# Altium schematic sheet Sheet2.SchDoc
size A2; SheetNumber: 1; SheetTotal: 1
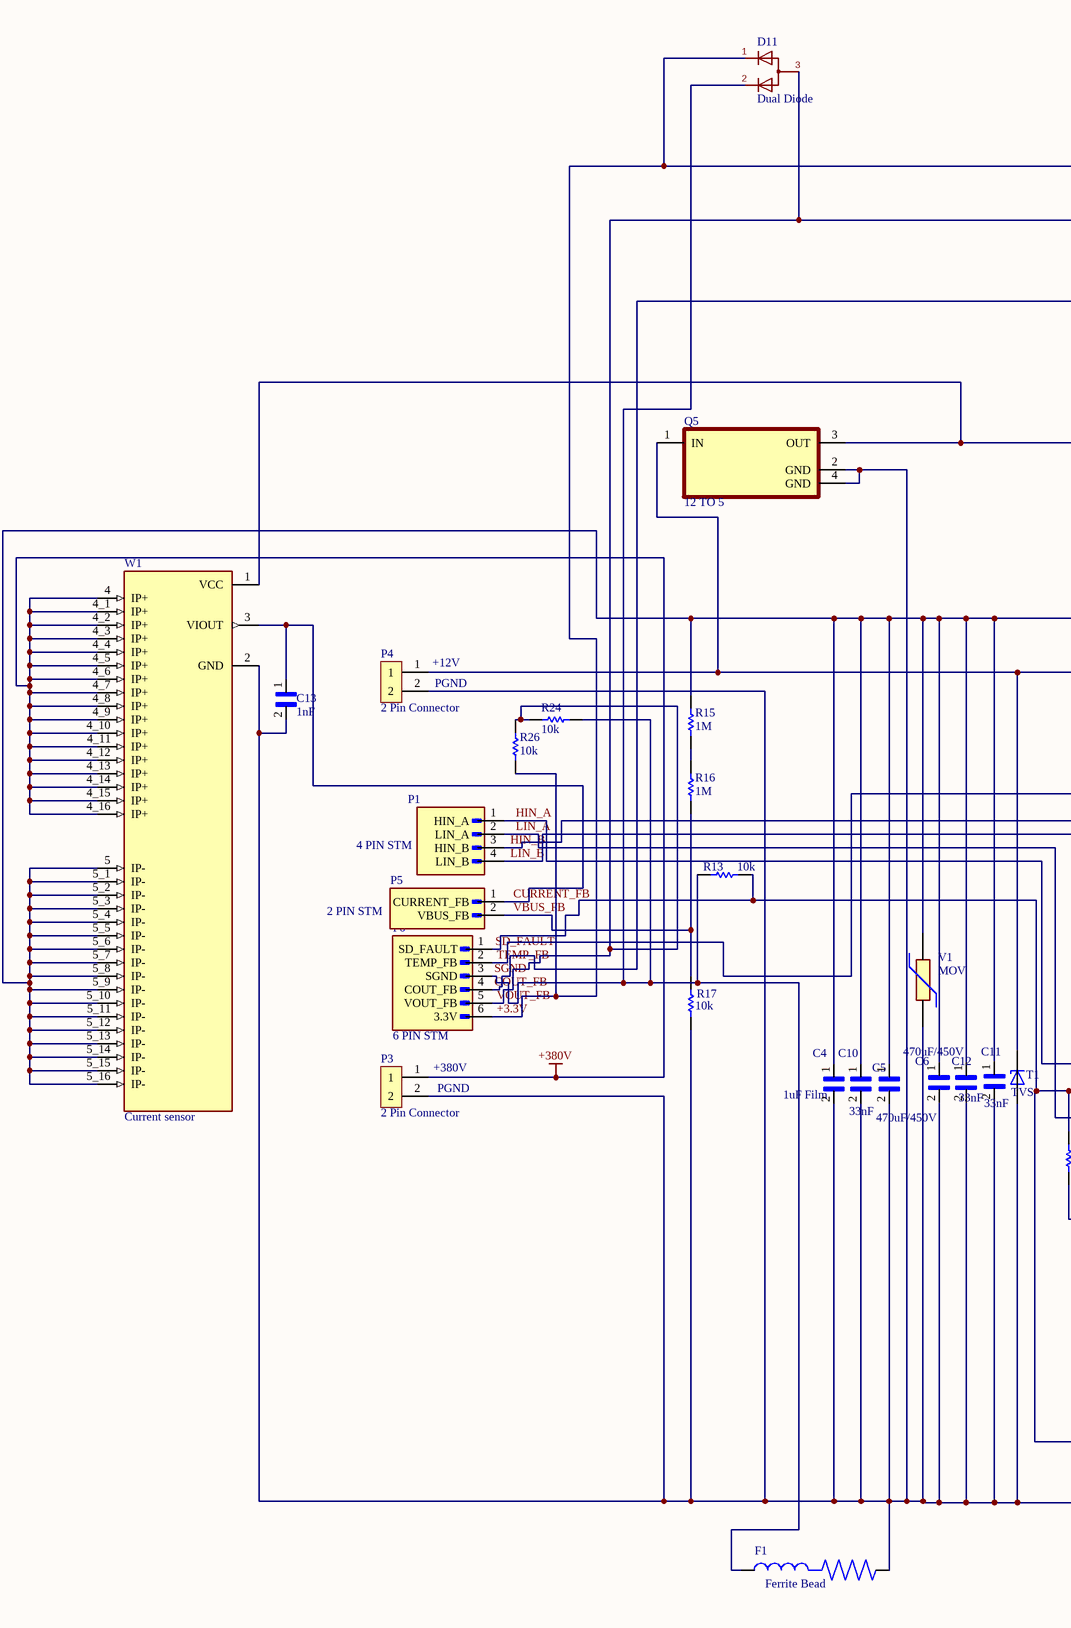
[diagram p0: Sheet2.SchDoc, left]
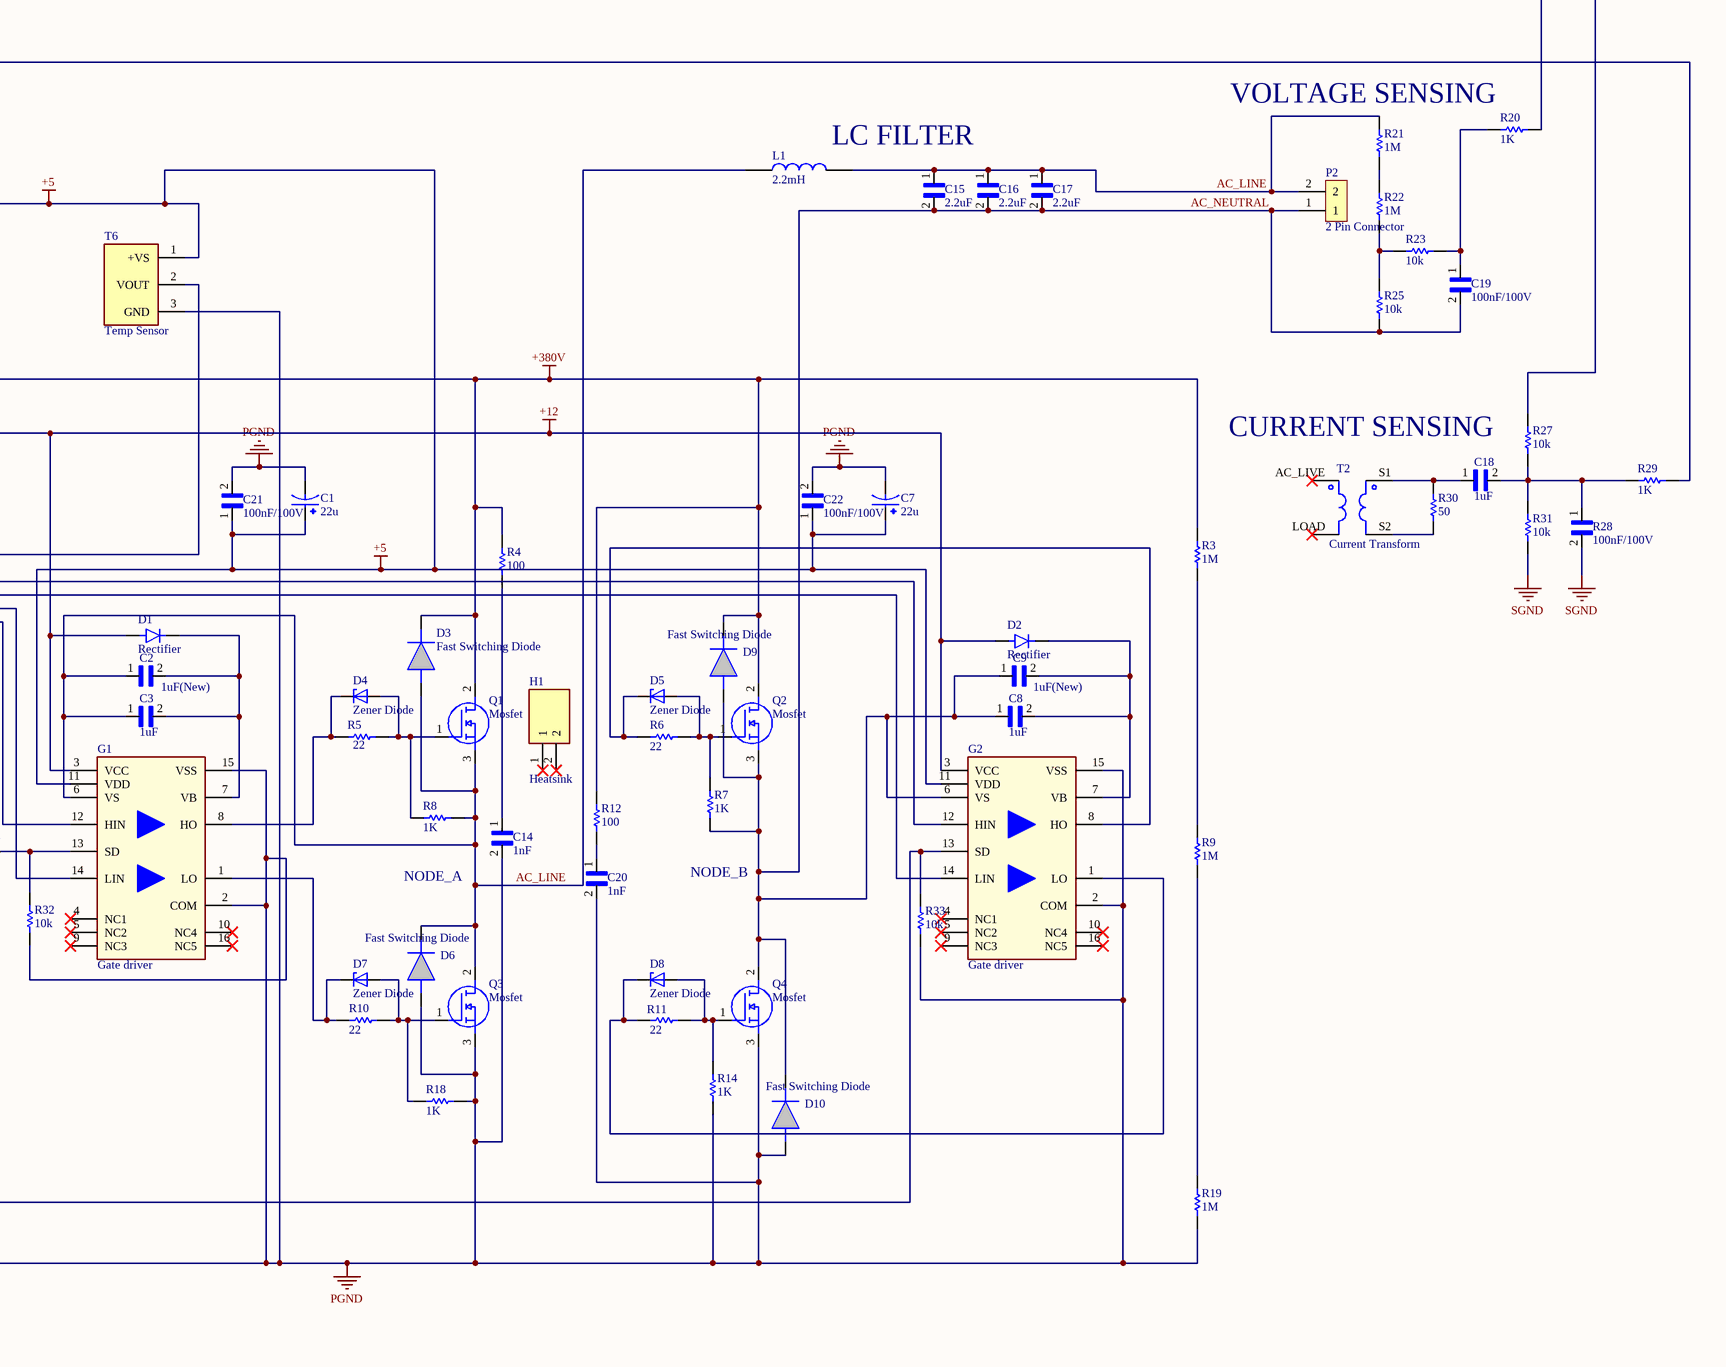
[diagram p1: Sheet2.SchDoc, right]

## Parts
C1  22u  [22uF]
C2  1uF(New)  [1uF(New)]
C3  1uF  [1uF]
C4  1uF Film  [1.0uF/630V]
C5  470uF/450V  [470 µF/450 V]
C6  470uF/450V  [470 µF/450 V]
C7  22u  [22uF]
C8  1uF  [1uF]
C9  1uF(New)  [1uF(New)]
C10  33nF  [33nF]
C11  33nF  [33nF]
C12  33nF  [33nF]
C13  1nF  [1nF]
C14  1nF  [1nF]
C15  2.2uF  [2.2uF]
C16  2.2uF  [2.2uF]
C17  2.2uF  [2.2uF]
C18  1uF  [1uF]
C19  100nF/100V  [100nF/100V]
C20  1nF  [1nF]
C21  100nF/100V  [100nF/100V]
C22  100nF/100V  [100nF/100V]
D1  Rectifier  [Rectifier]
D2  Rectifier  [Rectifier]
D3  Fast Switching Diode  [Fast Switching Diode]
D4  Zener Diode  [Zener Diode]
D5  Zener Diode  [Zener Diode]
D6  Fast Switching Diode  [Fast Switching Diode]
D7  Zener Diode  [Zener Diode]
D8  Zener Diode  [Zener Diode]
D9  Fast Switching Diode  [Fast Switching Diode]
D10  Fast Switching Diode  [Fast Switching Diode]
D11  Dual Diode  [Dual Diode]
F1  Ferrite Bead  [Ferrite Bead]
G1  Gate driver  [Gate Driver]
G2  Gate driver  [Gate Driver]
H1  Heatsink  [Heatsink]
L1  2.2mH  [2.2mH]
P1  4 PIN STM  [4 PIN STM]
P2  2 Pin Connector  [2 Pin Connector]
P3  2 Pin Connector  [2 Pin Connector]
P4  2 Pin Connector  [2 Pin Connector]
P5  2 PIN STM  [2 PIN STM]
P6  6 PIN STM  [6 PIN STM]
Q1  Mosfet  [Mosfet]
Q2  Mosfet  [Mosfet]
Q3  Mosfet  [Mosfet]
Q4  Mosfet  [Mosfet]
Q5  12 TO 5  [12 TO 5]
R3  1M  [1M]
R4  100  [100]
R5  22  [22]
R6  22  [22]
R7  1K  [1K]
R8  1K  [1K]
R9  1M  [1M]
R10  22  [22]
R11  22  [22]
R12  100  [100]
R13  10k  [10K]
R14  1K  [1K]
R15  1M  [1M]
R16  1M  [1M]
R17  10k  [10K]
R18  1K  [1K]
R19  1M  [1M]
R20  1K  [1K]
R21  1M  [1M]
R22  1M  [1M]
R23  10k  [10K]
R24  10k  [10K]
R25  10k  [10K]
R26  10k  [10K]
R27  10k  [10K]
R28  100nF/100V  [100nF/100V]
R29  1K  [1K]
R30  50  [50]
R31  10k  [10K]
R32  10k  [10K]
R33  10k  [10K]
T1  TVS  [TVS]
T2  Current Transform  [Current Transformer]
T6  Temp Sensor  [Temp Sensor]
V1  MOV  [MOV]
W1  Current sensor  [Current Sensor]

## Nets
+5: C1.P C7.P C21.1 C22.1 G1.11(VDD) G2.11(VDD) Q5.3(OUT) T6.1(+VS) W1.1(VCC)
+12: D1.1 D2.1 G1.3(VCC) G2.3(VCC) P4.1 Q5.1(IN) T1.C
+380V: C4.1 C5.1 C6.1 C10.1 C11.1 C12.1 D3.1(K) D9.1(K) P3.1 Q1.2(D) Q2.2(D) R3.2 R4.2 R12.2 R15.2 V1.2 W1.4(IP+) W1.4_1(IP+) W1.4_2(IP+) W1.4_3(IP+) W1.4_4(IP+) W1.4_5(IP+) W1.4_6(IP+) W1.4_7(IP+) W1.4_8(IP+) W1.4_9(IP+) W1.4_10(IP+) W1.4_11(IP+) W1.4_12(IP+) W1.4_13(IP+) W1.4_14(IP+) W1.4_15(IP+) W1.4_16(IP+) W1.5(IP-) W1.5_1(IP-) W1.5_2(IP-) W1.5_3(IP-) W1.5_4(IP-) W1.5_5(IP-) W1.5_6(IP-) W1.5_7(IP-) W1.5_8(IP-) W1.5_9(IP-) W1.5_10(IP-) W1.5_11(IP-) W1.5_12(IP-) W1.5_13(IP-) W1.5_14(IP-) W1.5_15(IP-) W1.5_16(IP-)
PGND: C1.N C4.2 C5.2 C6.2 C7.N C10.2 C11.2 C12.2 C13.2 C14.2 C20.2 C21.2 C22.2 D6.2(A) D10.2(A) F1.2 G1.2(COM) G1.15(VSS) G2.2(COM) G2.15(VSS) P3.2 P4.2 Q3.3(S) Q4.3(S) Q5.2(GND) Q5.4(GND) R14.1 R17.1 R18.2 R19.1 R32.1 R33.1 T1.A T6.3(GND) V1.1 W1.2(GND)
SGND: D11.2(C) F1.1 P6.3(SGND) R13.1 R24.1 R28.2 R31.1
+3.3V: D11.1(C) P6.6(3.3V) R26.1 R27.2
AC_LINE: C2.1 C3.1 C15.1 C16.1 C17.1 D3.2(A) D6.1(K) G1.6(VS) L1.1 L1.2 P2.2 Q1.3(S) Q3.2(D) R8.2 R21.2
AC_NEUTRAL: C8.1 C9.1 C15.2 C16.2 C17.2 C19.2 D9.2(A) D10.1(K) G2.6(VS) P2.1 Q2.3(S) Q4.2(D) R7.1 R25.1
COUT_FB: P6.4(COUT_FB) R29.2
CURRENT_FB: C13.1 P5.1(CURRENT_FB) W1.3(VIOUT)
HIN_A: G1.12(HIN) P1.1(HIN_A)
HIN_B: G2.12(HIN) P1.3(HIN_B)
LIN_A: G1.14(LIN) P1.2(LIN_A)
LIN_B: G2.14(LIN) P1.4(LIN_B)
SD_FAULT: G1.13(SD) G2.13(SD) P6.1(SD_FAULT) R13.2 R32.2 R33.2
TEMP_FB: P6.2(TEMP_FB) T6.2(VOUT)
VBUS_FB: P5.2(VBUS_FB) R16.1 R17.2
VOUT_FB: D11.3(A) P6.5(VOUT_FB) R20.2 R24.2 R26.2
NetC2_2: C2.2 C3.2 D1.2 G1.7(VB)
NetC8_2: C8.2 C9.2 D2.2 G2.7(VB)
NetC14_1: C14.1 R4.1
NetC18_1: C18.1 R30.2 T2.S1
NetC18_2: C18.2 R27.1 R28.1 R29.1 R31.2
NetC19_1: C19.1 R20.1 R23.1
NetC20_1: C20.1 R12.1
NetD4_1: D4.1(K) G1.8(HO) R5.1
NetD4_2: D4.2(A) Q1.1(G) R5.2 R8.1
NetD5_1: D5.1(K) G2.8(HO) R6.1
NetD5_2: D5.2(A) Q2.1(G) R6.2 R7.2
NetD7_1: D7.1(K) G1.1(LO) R10.1
NetD7_2: D7.2(A) Q3.1(G) R10.2 R18.1
NetD8_1: D8.1(K) G2.1(LO) R11.1
NetD8_2: D8.2(A) Q4.1(G) R11.2 R14.2
NetR3_1: R3.1 R9.2
NetR9_1: R9.1 R19.2
NetR15_1: R15.1 R16.2
NetR21_1: R21.1 R22.2
NetR22_1: R22.1 R23.2 R25.2
NetR30_1: R30.1 T2.S2

Not connected (* = marked no-connect by the designer): G1 4(NC1)* 5(NC2)* 9(NC3)* 10(NC4)* 16(NC5)*; G2 4(NC1)* 5(NC2)* 9(NC3)* 10(NC4)* 16(NC5)*; H1 1* 2*; T2 AC_LIVE(2A)* LOAD(1A)*

## Notes on the sheet
- LC FILTER
- (near R21) VOLTAGE SENSING
- (near P4) +12V
- (near P4) PGND
- CURRENT SENSING
- +380V
- (near P3) PGND
- NODE_A
- (near R7) NODE_B

## Library data of the parts
C1 C7 = 22u: EEU-FR1H220
C2 C9 = 1uF(New): CL21B105MBFNNNE
C3 C8 C18 = 1uF: C1206C105K1RACTU
C4 = 1uF Film: ECW-FE2J105QD
C5 C6 = 470uF/450V: ELG477M450AT6AA
C10-C12 = 33nF: ECW-FD2J333JB
C13 C14 C20 = 1nF: C315C102KAG5TA
C15-C17 = 2.2uF: ECWFE2W225KA
C19 C21 C22 R28 = 100nF/100V: C1210C104K1RACAUTO
D1 D2 = Rectifier: MUR160G
D3 D6 D9 D10 = Fast Switching Diode: 1N4148W-7-F
D4 D5 D7 D8 = Zener Diode: BZT52C18
D11 = Dual Diode: BAT54C
F1 = Ferrite Bead: BLM21PG221SN1D
G1 G2 = Gate driver: IR2110
H1 = Heatsink: 694-100
L1 = 2.2mH: RLB0914-222KL
P1 = 4 PIN STM: M20-9990446
P2-P4 = 2 Pin Connector: KF301-2P
P5 = 2 PIN STM: M20-9990246
P6 = 6 PIN STM: M20-9990646
Q1-Q4 = Mosfet: STW69N65M5
Q5 = 12 TO 5: LM7805S
R3 R9 R15 R16 R19 R21 R22 = 1M: PTF651M0000BYEA
R4 R12 = 100: CFR-25JB-52-100R
R5 R6 R10 R11 = 22: CFR-25JR-52-22R
R7 R8 R14 R18 R20 R29 = 1K: MF0207FRE52-1K
R13 R17 R23-R27 R31-R33 = 10k: RC1206FR-0710KL
R30 = 50: MF0207FTE52-49R9
T1 = TVS: SMAJ15A
T2 = Current Transform: ZMCT103C
T6 = Temp Sensor: LM35DZ
V1 = MOV: B72220S0421K101
W1 = Current sensor: ACS758LCB-050B-PFF-T